# Altium schematic sheet Peripheral.SchDoc: Peripheral
size A4; Author: DODANHLUONG; Revision: 1.0; SheetNumber: 6; SheetTotal: 6; ProjectTitle: KIT ARDUINO VERSION 1.0
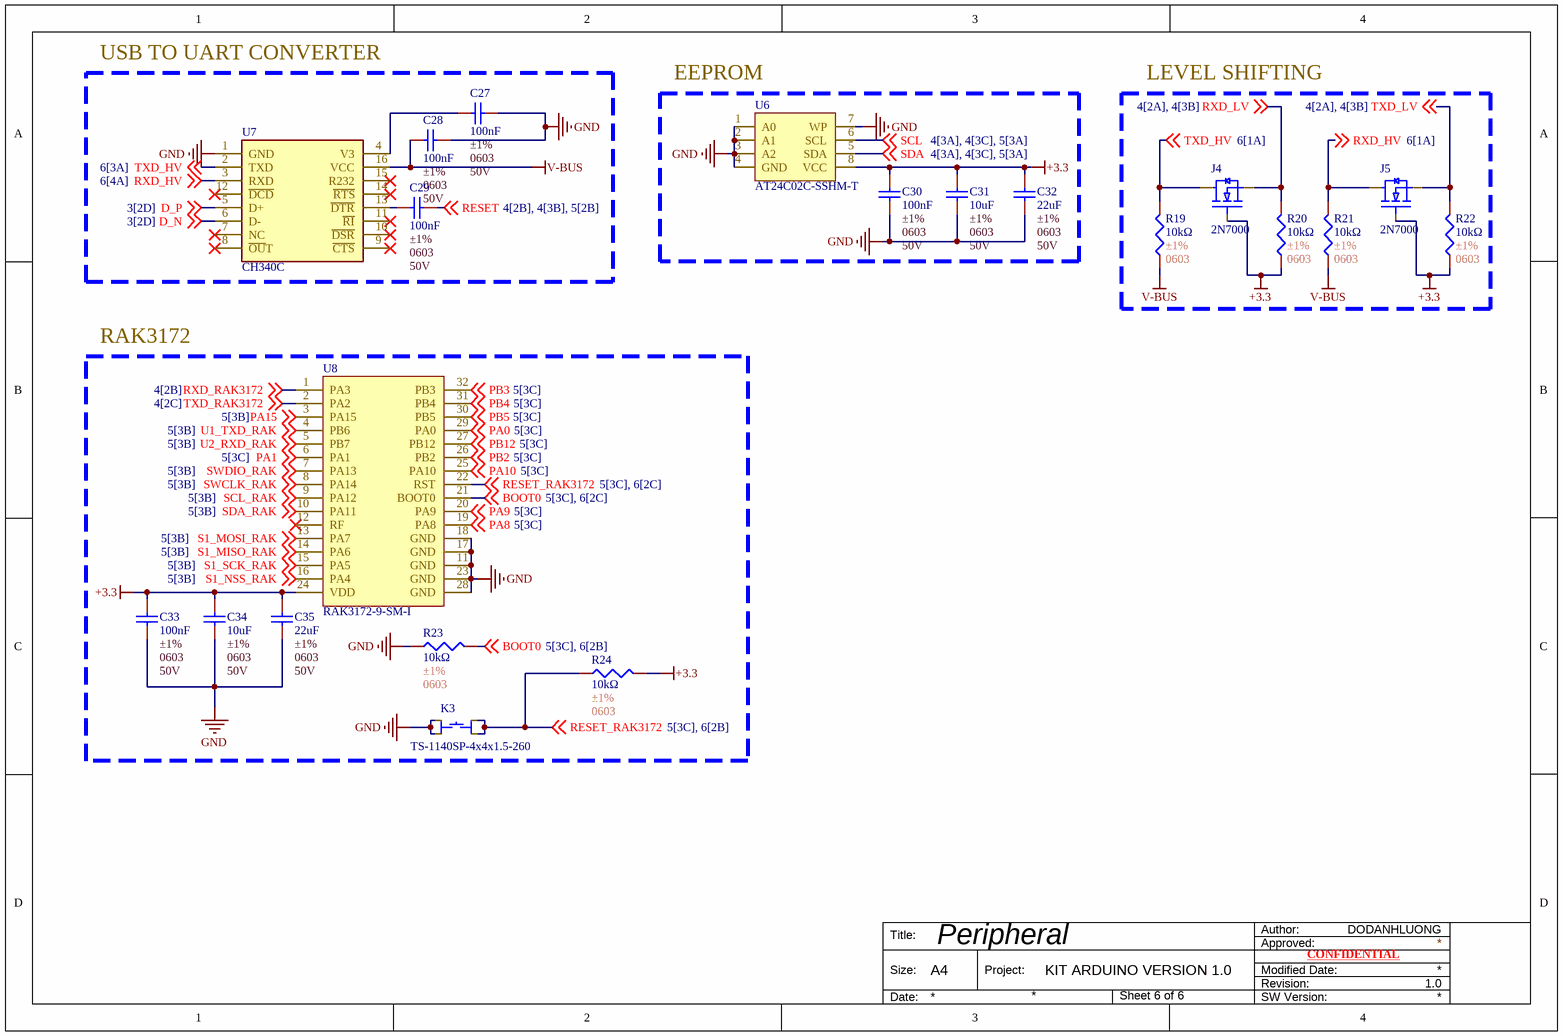
[diagram p0: Peripheral.SchDoc]

## Parts
C27  100nF  Tolerance: ±1%  Package: 0603  Voltage Rating: 50V  [C0603]
C28  100nF  Tolerance: ±1%  Package: 0603  Voltage Rating: 50V  [C0603]
C29  100nF  Tolerance: ±1%  Package: 0603  Voltage Rating: 50V  [C0603]
C30  100nF  Tolerance: ±1%  Package: 0603  Voltage Rating: 50V  [C0603]
C31  10uF  Tolerance: ±1%  Package: 0603  Voltage Rating: 50V  [C0603]
C32  22uF  Tolerance: ±1%  Package: 0603  Voltage Rating: 50V  [C0603]
C33  100nF  Tolerance: ±1%  Package: 0603  Voltage Rating: 50V  [C0603]
C34  10uF  Tolerance: ±1%  Package: 0603  Voltage Rating: 50V  [C0603]
C35  22uF  Tolerance: ±1%  Package: 0603  Voltage Rating: 50V  [C0603]
J4  2N7000  [2N7000]
J5  2N7000  [2N7000]
K3  TS-1140SP-4x4x1.5-260  [4x4x1.5]
R19  10kΩ  Tolerance: ±1%  Package: 0603  [R0603]
R20  10kΩ  Tolerance: ±1%  Package: 0603  [R0603]
R21  10kΩ  Tolerance: ±1%  Package: 0603  [R0603]
R22  10kΩ  Tolerance: ±1%  Package: 0603  [R0603]
R23  10kΩ  Tolerance: ±1%  Package: 0603  [R0603]
R24  10kΩ  Tolerance: ±1%  Package: 0603  [R0603]
U6  AT24C02C-SSHM-T  [AT24C02C-SSHM-T]
U7  CH340C  [CH340C]
U8  RAK3172-9-SM-I  [RAK3172-9-SM-I]

## Blocks framed on the sheet
USB TO UART CONVERTER: C27-C29 U7
EEPROM: C30-C32 U6
LEVEL SHIFTING: J4 J5 R19-R22
RAK3172: C33-C35 K3 R23 R24 U8

## Nets
+3.3: C30.1 C31.1 C32.1 C33.1 C34.1 C35.1 J4.2(G) J5.2(G) R20.1 R22.1 R24.2 U6.8(VCC) U8.24(VDD)
GND: C27.2 C28.2 C30.2 C31.2 C32.2 C33.2 C34.2 C35.2 K3.1 K3.3 R23.1 U6.1(A0) U6.2(A1) U6.3(A2) U6.4(GND) U6.7(WP) U7.1(GND) U8.11(GND) U8.17(GND) U8.18(GND) U8.23(GND) U8.28(GND)
V-BUS: C28.1 R19.1 R21.1 U7.16(VCC)
BOOT0: R23.2 U8.21(BOOT0) ; off-sheet BOOT0
D_N: U7.6(D-) ; off-sheet D_N
D_P: U7.5(D+) ; off-sheet D_P
PA0: U8.29(PA0) ; off-sheet PA0
PA1: U8.6(PA1) ; off-sheet PA1
PA8: U8.19(PA8) ; off-sheet PA8
PA9: U8.20(PA9) ; off-sheet PA9
PA10: U8.25(PA10) ; off-sheet PA10
PA15: U8.3(PA15) ; off-sheet PA15
PB2: U8.26(PB2) ; off-sheet PB2
PB3: U8.32(PB3) ; off-sheet PB3
PB4: U8.31(PB4) ; off-sheet PB4
PB5: U8.30(PB5) ; off-sheet PB5
PB12: U8.27(PB12) ; off-sheet PB12
RESET: C29.2 ; off-sheet RESET
RESET_RAK3172: K3.2 K3.4 R24.1 U8.22(RST) ; off-sheet RESET_RAK3172
RXD_HV: J5.3(D) R21.2 U7.3(RXD) ; off-sheet RXD_HV
RXD_LV: J4.1(S) R20.2 ; off-sheet RXD_LV
RXD_RAK3172: U8.1(PA3) ; off-sheet RXD_RAK3172
S1_MISO_RAK: U8.14(PA6) ; off-sheet S1_MISO_RAK
S1_MOSI_RAK: U8.13(PA7) ; off-sheet S1_MOSI_RAK
S1_NSS_RAK: U8.16(PA4) ; off-sheet S1_NSS_RAK
S1_SCK_RAK: U8.15(PA5) ; off-sheet S1_SCK_RAK
SCL: U6.6(SCL) ; off-sheet SCL
SCL_RAK: U8.9(PA12) ; off-sheet SCL_RAK
SDA: U6.5(SDA) ; off-sheet SDA
SDA_RAK: U8.10(PA11) ; off-sheet SDA_RAK
SWCLK_RAK: U8.8(PA14) ; off-sheet SWCLK_RAK
SWDIO_RAK: U8.7(PA13) ; off-sheet SWDIO_RAK
TXD_HV: J4.3(D) R19.2 U7.2(TXD) ; off-sheet TXD_HV
TXD_LV: J5.1(S) R22.2 ; off-sheet TXD_LV
TXD_RAK3172: U8.2(PA2) ; off-sheet TXD_RAK3172
U1_TXD_RAK: U8.4(PB6) ; off-sheet U1_TXD_RAK
U2_RXD_RAK: U8.5(PB7) ; off-sheet U2_RXD_RAK
NetC27_1: C27.1 U7.4(V3)
NetC29_1: C29.1 U7.13(~{DTR})

Not connected (* = marked no-connect by the designer): U7 7(NC)* 8(~{OU}T)* 9(~{CTS})* 10(~{DSR})* 11(~{RI})* 12(~{DCD})* 14(~{RTS})* 15(R232)*; U8 12(RF)*

## Notes on the sheet
- Author:
- Title:
- Size:
- A4
- Project:
- Approved:
- Revision:
- Modified Date:
- CONFIDENTIAL
- Date:
- SW Version:

## Library data of the parts
C27-C30 C33 = C0603_100nF_±1%: 50V 10pF NP0 ±1% 0402 Multilayer Ceramic Capacitors MLCC - SMD/SMT ROHS; Manufacturer: YAGEO; Mfr. Part #: CC0402FRNPO9BN100; LCSC Part #: C513681; Link: https://www.lcsc.com/product-detail/C513681.html?s_z=n_capital%2520yageo%252010pF%25200402; Capacitance: 100nF
C31 C34 = C0603_10uF_±1%: 50V 10pF NP0 ±1% 0402 Multilayer Ceramic Capacitors MLCC - SMD/SMT ROHS; Manufacturer: YAGEO; Mfr. Part #: CC0402FRNPO9BN100; LCSC Part #: C513681; Link: https://www.lcsc.com/product-detail/C513681.html?s_z=n_capital%2520yageo%252010pF%25200402; Capacitance: 10uF
C32 C35 = C0603_22uF_±1%: 50V 10pF NP0 ±1% 0402 Multilayer Ceramic Capacitors MLCC - SMD/SMT ROHS; Manufacturer: YAGEO; Mfr. Part #: CC0402FRNPO9BN100; LCSC Part #: C513681; Link: https://www.lcsc.com/product-detail/C513681.html?s_z=n_capital%2520yageo%252010pF%25200402; Capacitance: 22uF
J4 J5 = 2N7000: 60V 200mA 400mW 5Ω@10V 3V@1mA 1 N-Channel TO-92-3L MOSFETs ROHS; Manufacturer: onsemi; Mfr. Part #: 2N7000; LCSC Part #: C232838; Package: TO-92-3L; Current - Continuous Drain(Id): 200mA; Drain to Source Voltage: 60V; Link: https://www.lcsc.com/product-detail/C232838.html?s_z=n_2n7000; Gate Threshold Voltage (Vgs(th)): 3V@1mA; RDS(on): 5Ω@10V; Type: N-Channel
K3 = TS-1140SP-4x4x1.5-260: SMD Tactile Switches ROHS; Manufacturer: CAX; Mfr. Part #: TS-1140SP-4x4x1.5-260; LCSC Part #: C49023394; Package: SMD; Link: https://www.lcsc.com/product-detail/C49023394.html?s_z=n_button%25204x4
R19-R24 = R0603_10kΩ_±1%: 62.5mW Thick Film Resistor 50V ±1% ±200ppm/℃ 10Ω 0402 Chip Resistor - Surface Mount ROHS; Manufacturer: YAGEO; Mfr. Part #: RC0402FR-0710RL; LCSC Part #: C138066; Resistance: 10kΩ; Link: https://www.lcsc.com/product-detail/C138066.html?s_z=n_resistor%25200402%252010R
U6 = AT24C02C-SSHM-T: 2Kbit 1MHz I2C SOIC-8 EEPROM ROHS; Manufacturer: MICROCHIP; Key Attributes: I²C-Compatible (2-wire) Serial EEPROM; Write Cycle Endurance: 1,000,000 Cycles; Voltage - Supply: 1.7V~5.5V; Mfr. Part #: AT24C02C-SSHM-T; LCSC Part #: C6203; Package: SOIC-8; Link: https://www.lcsc.com/product-detail/C6203.html?s_z=n_24C02; Interface: I2C; Memory Size: 2Kbit
U7 = CH340C: 2Mbps Transceiver USB 2.0 SOP-16 USB Converters ROHS; Manufacturer: WCH; Voltage - Supply: 3.3V;5V; LCSC Part #: C84681; Package: SOP-16; Link: https://www.lcsc.com/product-detail/C84681.html?s_z=n_CH340C; Mfr. Part #: CH340C
U8 = RAK3172-9-SM-I: 15km SMD,15.5x15mm LoRa Modules ROHS; Manufacturer: RAKwireless; Key Attributes: WisDuo LPWAN Module; Voltage - Supply: 2V~3.6V; Antenna Type: IPEX Connector; Interface Type: UART;SPI;I2C; Package: SMD,15.5x15mm; LCSC Part #: C19723905; Mfr. Part #: RAK3172-9-SM-I; Link: https://www.lcsc.com/product-detail/C19723905.html?s_z=n_RAK3172